# Altium schematic sheet Sheet1.SchDoc: Flyback SMPS
size A3; DocumentNumber: 1; SheetNumber: 1; SheetTotal: 1; SPICEModelCacheZDEPEACZ: <root> / <DocumentId>ZDEPEACZ</DocumentId> / <CacheFrame Number="0"> / <Model Name="890324025017cs_100nf" Kind="CKT"> / <Text>******* / .subckt 890324025017CS_100nF 1 2 / Rser 1 3 0.072 / Lser 2 4 0.000000004703 / C1 3 4 0.0000001 / Rpar 3 4 30000000000 / .ends 890324025017CS_100nF</Text> / </Model> / <Model Name="1206_885012208058_100nf" Kind="CKT"> / <Text>******* / .subckt 1206_885012208058_100nF 1 2 / Rser 1 3 0.0232208356231 / Lser 2 4 5.59299026E-10 / C1 3 4 0.0000001 / Rpar 3 4 5000000000 / .ends 1206_885012208058_100nF</Text> / </Model> / <Model Name="0603_885012006085_1nf" Kind="CKT"> / <Text>******* / .subckt 0603_885012006085_1nF 1 2 / Rser 1 3 0.0532527583524 / Lser 2 4 3.27557981E-10 / C1 3 4 0.000000001 / Rpar 3 4 10000000000 / .ends 0603_885012006085_1nF</Text> / </Model> / <Model Name="1210_885012209019_100nf" Kind="CKT"> / <Text>******* / .subckt 1210_885012209019_100nF 1 2 / Rser 1 3 0.0209574310072 / Lser 2 4 5.49171232E-10 / C1 3 4 0.0000001 / Rpar 3 4 5000000000 / .ends 1210_885012209019_100nF</Text> / </Model> / <Model Name="1206_885012208042_220pf" Kind="CKT"> / <Text>******* / .subckt 1206_885012208042_220pF 1 2 / Rser 1 3 0.58352 / Lser 2 4 0.00000000032083 / C1 3 4 0.00000000022 / Rpar 3 4 10000000000 / .ends 1206_885012208042_220pF</Text> / </Model> / </CacheFrame> / </root>
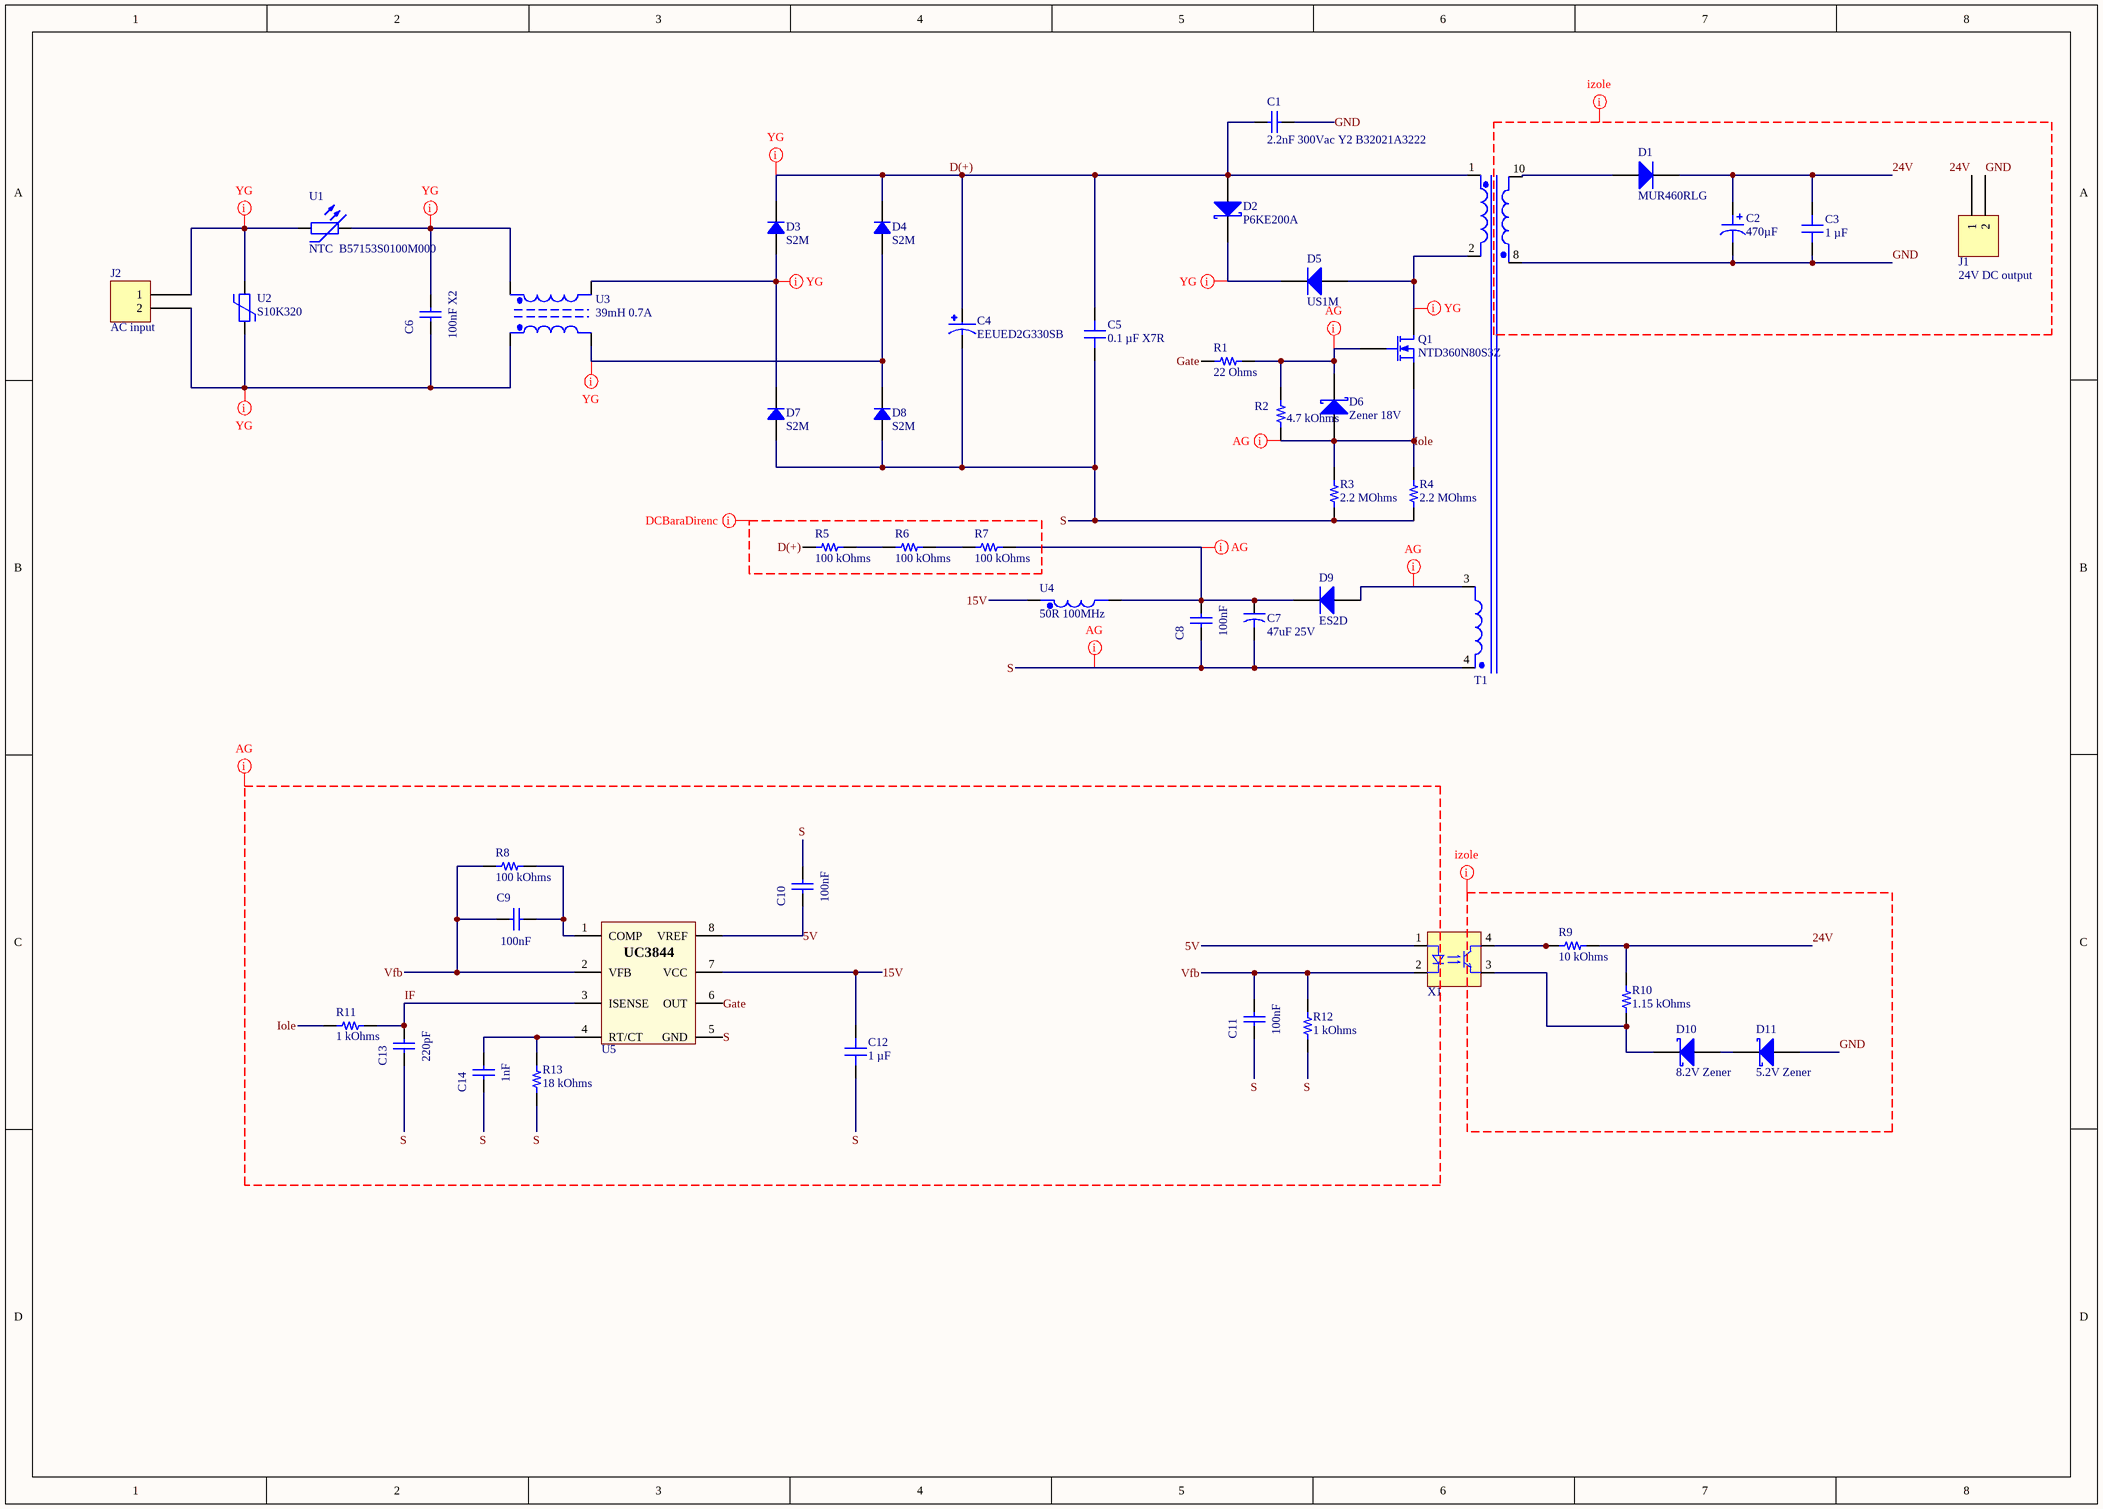
[diagram p0: Sheet1.SchDoc]

## Parts
C1  2.2nF 300Vac Y2 B32021A3222  [4x13x9]
C2  470µF  [CAP TH ALUM ELEC D10.00mm S5.00mm H20.00mm]
C3  1 µF  [CAP 1206_3216 - 0.8MM]
C4  EEUED2G330SB  [CAPPRD750W80D1600H2000]
C5  0.1 µF X7R  [CAP 1210_3225 - 1MM]
C6  100nF X2  [WCAP-FTX2_L18W6H12]
C7  47uF 25V  [CAPPRD200W50D525H1250]
C8  100nF  [WCAP-CSGP_1206_L3.2W1.6H0.8]
C9  100nF  [WCAP-CSGP_1210_L3.2W2.5H0.95]
C10  100nF  [WCAP-CSGP_1210_L3.2W2.5H0.95]
C11  100nF  [WCAP-CSGP_1210_L3.2W2.5H0.95]
C12  1 µF  [MURATA CAP GRM31C 1206_3216]
C13  220pF  [WCAP-CSGP_1206_L3.2W1.6H0.8]
C14  1nF  [WCAP-CSGP_0603_L1.6W0.8H0.8_Reflow]
D1  MUR460RLG  [DO-201AD -Dik]
D2  P6KE200A  [DO-15((DO-204AC)]
D3  S2M  [DO214AA SMB]
D4  S2M  [DO214AA SMB]
D5  US1M  [DO-214AA(SMB)]
D6  Zener 18V  [SOD-123]
D7  S2M  [DO214AA SMB]
D8  S2M  [DO214AA SMB]
D9  ES2D  [DO-214AA(SMB)]
D10  8.2V Zener  [SOD-123]
D11  5.2V Zener  [SOD-123]
J1  24V DC output  [JST S2B-PH-SM4-TB]
J2  AC input  [TE 282837-2]
Q1  NTD360N80S3Z  [DPAK IGBT]
R1  22 Ohms  [YAGEO RES 1206_3216]
R2  4.7 kOhms  [RES 1206_3216]
R3  2.2 MOhms  [YAGEO RES 1206_3216]
R4  2.2 MOhms  [YAGEO RES 1206_3216]
R5  100 kOhms  [YAGEO RES 1206_3216]
R6  100 kOhms  [YAGEO RES 1206_3216]
R7  100 kOhms  [YAGEO RES 1206_3216]
R8  100 kOhms  [RES 1206_3216]
R9  10 kOhms  [RES 1206_3216]
R10  1.15 kOhms  [RES 1206_3216]
R11  1 kOhms  [YAGEO RES 1206_3216]
R12  1 kOhms  [YAGEO RES 1206_3216]
R13  18 kOhms  [RES 1206_3216]
T1  SMPS Tr  [SMPS Tr3]  (value not drawn)
U1  NTC  B57153S0100M000  [NTC B57153S0100]
U2  S10K320  [Varistor630V]
U3  39mH 0.7A  [EMC SMPS TDK]
U4  50R 100MHz  [1206 Bead]
U5  UC3844  [SOIC-OA8_L]  (value not drawn)
X1  PC81710NIP1B  [PC817 SMD]  (value not drawn)

## Nets
5V: C10.1 U5.8(VREF) X1.1(A)
15V: C12.2 U4.1 U5.7(VCC)
24V: C2.1 C3.2 D1.2(K) J1.1 R9.2 R10.2
D(+): C1.1 C4.P C5.2 D2.1(A) D3.2 D4.2 R5.1 T1.1(Pri+)
Gate: R1.1 U5.6(OUT)
GND: C1.2 C2.2 C3.1 D11.1(A) J1.2 T1.8
IF: C13.2 R11.2 U5.3(ISENSE)
Iole: D6.1(A) Q1.3(S) R2.1 R3.2 R4.2 R11.1
S: C4.N C5.1 C7.2 C8.1 C10.2 C11.1 C12.1 C13.1 C14.1 D7.1 D8.1 R3.1 R4.1 R12.1 R13.1 T1.4(Sec3-) U5.5(GND)
Vfb: C9.1 C11.2 R8.1 R12.2 U5.2(VFB) X1.2(K)
NetC6_1: C6.1 J2.2 U2.1 U3.1
NetC6_2: C6.2 U1.2 U3.2
NetC7_1: C7.1 C8.2 D9.2(K) R7.2 U4.2
NetC9_2: C9.2 R8.2 U5.1(COMP)
NetC14_2: C14.2 R13.2 U5.4(RT/CT)
NetD1_1: D1.1(A) T1.10(Sec1+)
NetD2_2: D2.2(K) D5.2(K)
NetD3_1: D3.1 D7.2 U3.3
NetD4_1: D4.1 D8.2 U3.4
NetD5_1: D5.1(A) Q1.2(D) T1.2(Pri-)
NetD6_2: D6.2(K) Q1.1(G) R1.2 R2.2
NetD9_1: D9.1(A) T1.3(Sec3+)
NetD10_1: D10.1(A) D11.2(K)
NetD10_2: D10.2(K) R10.1 X1.3(E)
NetJ2_1: J2.1 U1.1 U2.2
NetR5_2: R5.2 R6.1
NetR6_2: R6.2 R7.1
NetR9_1: R9.1 X1.4(C)

## Layout directives
net class YG: D(+), NetC6_1, NetC6_2, NetD2_2, NetD3_1, NetD4_1, NetD5_1, NetJ2_1
net class AG: 5V, 15V, Gate, IF, Iole, NetC7_1, NetD6_2, NetD9_1, S, Vfb
net class izole: 24V, GND
net class DCBaraDirenc: D(+)

## Library data of the parts
C1 = Cap Y2 2.2nF 300V MKP TDK: 495-4967-1-ND; Published: 8-Jun-2000; LatestRevisionDate: 17-Jul-2002; LatestRevisionNote: Re-released for DXP Platform.; PackageReference: RAD-0.3; Publisher: Altium Limited; PackageDescription: Radial Cap, Thru-Hole; 2 Leads; 0.3 in Pin Spacing
C2 = EEU-FC1V471: CAP ALUM 470UF 20% 35V RADIAL; manufacturer: Panasonic Electronic Components; Impedance: 52 mOhms; Lifetime @ Temp.: 3000 Hrs @ 105°C; Polarization: Polar; Ripple Current @ High Frequency: 1.22A @ 100kHz; Ripple Current @ Low Frequency: 915mA @ 120Hz; Part Number: EEU-FC1V471; Applications: Automotive; Capacitance: 470µF; componentlink1description: Datasheet; componentlink1url: http://industrial.panasonic.com/www-cgi/jvcr13pz.cgi?E+PZ+3+ABA0022+EEUFC1V471+7+WW; componentlink2description: DigiKey Link; componentlink2url: http://digikey.com/product-detail/en/panasonic-electronic-components/EEU-FC1V471/P10301-ND/266310; Device Package: Radial, Can; Height - Seated (Max): 0.787" (20.00mm); lastupdated: 2.09.2020 01:31:31; Lead Spacing: 0.197" (5.00mm); Lifecycle Status: Active; Minimum Order: 1; Mounting Type: Through Hole; Operating Temperature: -55°C ~ 105°C; Package / Case: Radial, Can; packaging: Bulk; partid: 12504; Part Status: Active; price: 0.75; Ratings: AEC-Q200; series: FC; Size / Dimension: 0.394" Dia (10.00mm); Supplier 1: DigiKey; Supplier Part Number 1: P10301-ND; Tolerance: ±20%; value: 470µF; Voltage - Rated: 35V
C3 = CL31B105KBHNNNE: CAP CER 1UF 50V X7R 1206; manufacturer: Samsung Electro-Mechanics; Tolerance: ±10%; Part Number: CL31B105KBHNNNE; Capacitance: 1 µF; Applications: General Purpose; componentlink1description: Datasheet; componentlink1url: http://www.samsungsem.com/kr/support/product-search/mlcc/CL31B105KBHNNNE.jsp; componentlink2description: DigiKey Link; componentlink2url: https://www.digikey.com/en/products/detail/samsung-electro-mechanics/CL31B105KBHNNNE/3886726; Device Package: 1206 (3216 Metric); lastupdated: 4.06.2024 19:10:30; Lifecycle Status: Active; Minimum Order: 1; Mounting Type: Surface Mount, MLCC; Operating Temperature: -55°C ~ 125°C; Package / Case: 1206 (3216 Metric); packaging: TapeAndReel; partid: 43160; Part Status: Active; price: 0.02; series: CL; Size / Dimension: 0.126" L x 0.063" W (3.20mm x 1.60mm); Supplier 1: DigiKey; Supplier Part Number 1: 1276-1068-1-ND; Temperature Coefficient: X7R; Thickness (Max): 0.071" (1.80mm); value: 1 µF; Voltage - Rated: 50V
C4 = EEUED2G330SB: CAP ALUM 33UF 20% 400V RADIAL; MF: Panasonic; MP: EEU-ED2G330SB; Purchase-URL: https://pricing.snapeda.com/search/part/EEU-ED2G330SB/?ref=eda; Package: RADIAL-2 Panasonic; Check_prices: https://www.snapeda.com/parts/EEU-ED2G330SB/Panasonic/view-part/?ref=eda; SnapEDA_Link: https://www.snapeda.com/parts/EEU-ED2G330SB/Panasonic/view-part/?ref=snap; Price: None; Availability: In Stock; Value: *
C5 = 1210Y0500104KST: 1210 50VDC 100NF 10% X7R(2R1) AE; manufacturer: Knowles Syfer; Capacitance: 0.1 µF; Voltage - Rated: 50V; Part Number: 1210Y0500104KST; Value: 0.1 µF X7R; Applications: Automotive, Boardflex Sensitive; componentlink2description: DigiKey Link; componentlink2url: https://www.digikey.com/en/products/detail/knowles-syfer/1210Y0500104KST/18879780; Device Package: 1210 (3225 Metric); Features: Soft Termination; lastupdated: 4.06.2024 19:20:44; Lifecycle Status: Active; Minimum Order: 1; Mounting Type: Surface Mount, MLCC; Operating Temperature: -55°C ~ 125°C; Package / Case: 1210 (3225 Metric); packaging: TapeAndReel; partid: 53037; Part Status: Active; price: 0.16; Ratings: AEC-Q200; series: FlexiCap™; Size / Dimension: 0.126" L x 0.098" W (3.20mm x 2.50mm); Supplier 1: DigiKey; Supplier Part Number 1: 1608-1210Y0500104KSTCT-ND; Temperature Coefficient: X7R (2R1); Thickness (Max): 0.079" (2.00mm); Tolerance: ±10%
C6 = 890324025017CS: WCAP-FTX2 Film Capacitor, THT, L18 x W6 x H12mm, 100nF, 275V; Manufacturer: Wurth Elektronik; Capacitance Tolerance: +/-10%; Dissipation Factor @1kHz: 0.1%; Dissipation Factor @100kHz: 0.5%; Insulation Resistance: 30GΩ; Pitch: 15mm; Rate of Voltage Rise: 300V/μs; Technical Reference: MX2P015104K275ACPP46004; Manufacturer Part Number: 890324025017CS; Category: Film Capacitors; Match Code: WCAP-FTX2; ComponentLink1Description: Website Link; ComponentLink1URL: https://www.we-online.com/redexpert/article/890324025017CS?ad; ComponentLink2Description: Datasheet Link; ComponentLink2URL: https://www.we-online.com/redexpert/spec/890324025017CS?ad; Mount: Through Hole; Min Operating Temperature: -40°C; Max Operating Temperature: 105°C; Packaging: Carton; Length: 18mm; Width: 6mm; Height: 12mm; Capacitance: 100nF; Dissipation Factor @10kHz: 0.1%; Rated Voltage (AC): 275V
C7 = C 47uF 25V 250mArms 400mOhm: 1189-1590-1-ND; ComponentLink1Description: http://www.rubycon.co.jp/en/catalog/e_pdfs/aluminum/e_px.pdf
C8 = 885012208058: WCAP-CSGP Multilayer Ceramic Chip Capacitor, General Purpose, size 1206, 100nF, 25V; Manufacturer: Wurth Elektronik; Case/Size Code: 1206; Capacitance Tolerance: +/-10%; Ceramic Type: X7R; Dissipation Factor: 3.5%; Insulation Resistance: 5GΩ; Technical Reference: X7R1206104K025DFCT10000; Manufacturer Part Number: 885012208058; Category: Multilayer Ceramic Chip Capacitors; Match Code: WCAP-CSGP; ComponentLink1Description: Website Link; ComponentLink1URL: https://www.we-online.com/redexpert/article/885012208058?ad; ComponentLink2Description: Datasheet Link; ComponentLink2URL: https://www.we-online.com/redexpert/spec/885012208058?ad; Mount: Surface Mount; Min Operating Temperature: -55°C; Max Operating Temperature: 125°C; Packaging: Tape and Reel; Length: 3.2mm; Width: 1.6mm; Height: 0.8mm; Capacitance: 100nF; Rated Voltage (DC): 25V
C9-C11 = 885012209019: WCAP-CSGP Multilayer Ceramic Chip Capacitor, General Purpose, size 1210, 100nF, 25V; Manufacturer: Wurth Elektronik; Case/Size Code: 1210; Capacitance Tolerance: +/-10%; Ceramic Type: X7R; Dissipation Factor: 3.5%; Insulation Resistance: 5GΩ; Technical Reference: X7R1210104K025DFCT10000; Manufacturer Part Number: 885012209019; Category: Multilayer Ceramic Chip Capacitors; Match Code: WCAP-CSGP; ComponentLink1Description: Website Link; ComponentLink1URL: https://www.we-online.com/redexpert/article/885012209019?ad; ComponentLink2Description: Datasheet Link; ComponentLink2URL: https://www.we-online.com/redexpert/spec/885012209019?ad; Mount: Surface Mount; Min Operating Temperature: -55°C; Max Operating Temperature: 125°C; Packaging: Tape and Reel; Length: 3.2mm; Width: 2.5mm; Height: 0.95mm; Capacitance: 100nF; Rated Voltage (DC): 25V
C12 = GRM31CR71E105KA01L: CAP CER 1UF 25V X7R 1206; manufacturer: Murata Electronics; Tolerance: ±10%; Part Number: GRM31CR71E105KA01L; Capacitance: 1 µF; Applications: General Purpose; componentlink1description: Datasheet; componentlink1url: https://search.murata.co.jp/Ceramy/image/img/A01X/G101/ENG/GRM31CR71E105KA01-01.pdf; componentlink2description: DigiKey Link; componentlink2url: https://www.digikey.com/en/products/detail/murata-electronics/GRM31CR71E105KA01L/7033132; Device Package: 1206 (3216 Metric); lastupdated: 6.09.2024 02:27:21; Lifecycle Status: Active; Minimum Order: 1; Mounting Type: Surface Mount, MLCC; Operating Temperature: -55°C ~ 125°C; Package / Case: 1206 (3216 Metric); packaging: TapeAndReel; partid: 59149; price: 0.15; series: GRM; Size / Dimension: 0.126" L x 0.063" W (3.20mm x 1.60mm); Supplier 1: DigiKey; Supplier Part Number 1: 490-GRM31CR71E105KA01LCT-ND; Temperature Coefficient: X7R; Thickness (Max): 0.071" (1.80mm); value: 1 µF; Voltage - Rated: 25V
C13 = 885012208042: WCAP-CSGP Multilayer Ceramic Chip Capacitor, General Purpose, size 1206, 220pF, 25V; Manufacturer: Wurth Elektronik; Case/Size Code: 1206; Capacitance Tolerance: +/-10%; Ceramic Type: X7R; Dissipation Factor: 3.5%; Insulation Resistance: 10GΩ; Technical Reference: X7R1206221K025DFCT10000; Manufacturer Part Number: 885012208042; Category: Multilayer Ceramic Chip Capacitors; Match Code: WCAP-CSGP; ComponentLink1Description: Website Link; ComponentLink1URL: https://www.we-online.com/redexpert/article/885012208042?ad; ComponentLink2Description: Datasheet Link; ComponentLink2URL: https://www.we-online.com/redexpert/spec/885012208042?ad; Mount: Surface Mount; Min Operating Temperature: -55°C; Max Operating Temperature: 125°C; Packaging: Tape and Reel; Length: 3.2mm; Width: 1.6mm; Height: 0.8mm; Capacitance: 220pF; Rated Voltage (DC): 25V
C14 = 885012006085: WCAP-CSGP Multilayer Ceramic Chip Capacitor, General Purpose, size 0603, 1nF, 100V; Manufacturer: Wurth Elektronik; Case/Size Code: 0603; Capacitance Tolerance: +/-5%; Ceramic Type: NP0; Insulation Resistance: 10GΩ; Q Factor: 1000; Technical Reference: NP00603102J100DFCT10000; Manufacturer Part Number: 885012006085; Category: Multilayer Ceramic Chip Capacitors; Match Code: WCAP-CSGP; ComponentLink1Description: Website Link; ComponentLink1URL: https://www.we-online.com/redexpert/article/885012006085?ad; ComponentLink2Description: Datasheet Link; ComponentLink2URL: https://www.we-online.com/redexpert/spec/885012006085?ad; Mount: Surface Mount; Min Operating Temperature: -55°C; Max Operating Temperature: 125°C; Packaging: Tape and Reel; Length: 1.6mm; Width: 0.8mm; Height: 0.8mm; Capacitance: 1nF; Rated Voltage (DC): 100V
D1 = Diyot DO-201AD Dik: MUR460RLGOSCT-ND
D2 = TVS 200V DO-15: 497-13419-1-ND; Note: Pin 2 is not connected and not drawn.; Published: 21-Mar-2003; LatestRevisionDate: 29-May-2009; LatestRevisionNote: IPC-7351 Footprint Added.; DatasheetVersion: Oct-1999; PackageVersion: Sep-2001; PackageReference: SOT-23; Publisher: Altium Limited; PackageDescription: 3-Pin SOT-23 Package 0.95 mm Pitch, 2.5 mm Lead Span; ComponentLink1Description: Manufacturer Link; ComponentLink1URL: http://www.infineon.com/; ComponentLink2Description: Datasheet; ComponentLink2URL: http://www.infineon.com/upload/Document/cmc_upload/documents/009/363/bat17series.pdf
D3 D4 D7 D8 = S2M: DIODE GEN PURP 1KV 2A DO214AA; Manufacturer: ON Semiconductor; Capacitance @ Vr, F: 30pF @ 4V, 1MHz; Current - Reverse Leakage @ Vr: 1µA @ 1000V; Diode Type: Standard; Reverse Recovery Time (trr): 2µs; Speed: Standard Recovery >500ns, > 200mA (Io); Voltage - DC Reverse (Vr) (Max): 1000V; Voltage - Forward (Vf) (Max) @ If: 1.15V @ 2A; Part Number: S2M; ComponentLink1Description: Datasheet; ComponentLink1URL: https://www.onsemi.com/pub/Collateral/S2M-D.pdf; ComponentLink2Description: DigiKey Link; ComponentLink2URL: http://digikey.com/product-detail/en/on-semiconductor/S2M/S2MFSCT-ND/2094442; Current - Average Rectified (Io): 2A; LastUpdated: 3.06.2024 19:53:56; Lifecycle Status: Active; Minimum Order: 1; Mounting Type: Surface Mount; Operating Temperature - Junction: -65°C ~ 150°C; Package / Case: DO-214AA, SMB; Packaging: TapeAndReel; PartId: 299; Part Status: Active; Price: 0.06; Series: -; Supplier 1: DigiKey; Supplier Part Number 1: S2MFSCT-ND; Supplier Device Package: DO-214AA (SMB)
D5 = US1M: SMA
D6 D10 D11 = Zener SOD-123: SOD-123; Note: Pin 2 is not connected and not drawn.; Published: 21-Mar-2003; LatestRevisionDate: 29-May-2009; LatestRevisionNote: IPC-7351 Footprint Added.; DatasheetVersion: Oct-1999; PackageVersion: Sep-2001; PackageReference: SOT-23; Publisher: Altium Limited; PackageDescription: 3-Pin SOT-23 Package 0.95 mm Pitch, 2.5 mm Lead Span; ComponentLink1Description: Manufacturer Link; ComponentLink1URL: http://www.infineon.com/; ComponentLink2Description: Datasheet; ComponentLink2URL: http://www.infineon.com/upload/Document/cmc_upload/documents/009/363/bat17series.pdf
D9 = D ES2D: ES2DFSCT-ND
J1 = S2B-PH-SM4-TB(LF)(SN): CONN HEADER SMD R/A 2POS 2MM; Manufacturer: JST Sales America Inc.; Contact Length - Mating: 0.130" (3.30mm); Current Rating (Amps): 2A; Material Flammability Rating: UL94 V-0; Number of Positions: 2; Number of Positions Loaded: All; Pitch - Mating: 0.079" (2.00mm); Shrouding: Shrouded - 4 Wall; Style: Board to Cable/Wire; Voltage Rating: 100V; Part Number: S2B-PH-SM4-TB(LF)(SN); ComponentLink1Description: Datasheet; ComponentLink1URL: http://www.jst-mfg.com/product/pdf/eng/ePH.pdf; ComponentLink2Description: DigiKey Link; ComponentLink2URL: http://digikey.com/product-detail/en/jst-sales-america-inc/S2B-PH-SM4-TB-LF-SN/455-1749-1-ND/926846; Connector Type: Header; Contact Finish - Mating: Tin; Contact Finish - Post: Tin; Contact Material: Copper Alloy; Contact Shape: Square; Contact Type: Male Pin; Fastening Type: Detent Lock; Features: Solder Retention; Insulation Color: Natural; Insulation Height: 0.217" (5.51mm); Insulation Material: Polyamide (PA6T), Nylon 6T; LastUpdated: 15.01.2020 03:45:11; Lifecycle Status: Active; Minimum Order: 1; Mounting Type: Surface Mount, Right Angle; Number of Rows: 1; Operating Temperature: -25°C ~ 85°C; Packaging: TapeAndReel; PartId: 115; Part Status: Active; Price: 0.27; Series: PH; Supplier 1: DigiKey; Supplier Part Number 1: 455-1749-1-ND; Termination: Solder
J2 = 282837-2: TERM BLK 2P SIDE ENT 5.08MM PCB; Manufacturer: TE Connectivity AMP Connectors; Current: 13.5 A; Mating Orientation: Horizontal with Board; Number of Levels: 1; Pitch: 0.200" (5.08mm); Positions Per Level: 2; Voltage: 300 V; Wire Gauge: 16-28 AWG; Wire Termination: Screw - Rising Cage Clamp; Part Number: 282837-2; Color: Green; ComponentLink1Description: Datasheet; ComponentLink1URL: https://www.te.com/commerce/DocumentDelivery/DDEController?Action=srchrtrv&DocNm=282837&DocType=Customer+Drawing&DocLang=English; ComponentLink2Description: DigiKey Link; ComponentLink2URL: https://www.digikey.com/en/products/detail/te-connectivity-amp-connectors/282837-2/2187973; Features: Interlocking (Side); LastUpdated: 21.06.2022 15:00:23; Lifecycle Status: Active; Minimum Order: 1; Mounting Type: Through Hole; Packaging: Tray; Part Status: Active; Price: 0.31; Series: Buchanan; Supplier 1: DigiKey; Supplier Part Number 1: A113320-ND
Q1 = MOSFET DPAK: DPAK; Published: 8-Jun-2000; LatestRevisionDate: 17-Jul-2002; LatestRevisionNote: Re-released for DXP Platform.; PackageVersion: 1995/1996; PackageReference: E3; Publisher: Altium Limited; PackageDescription: TO, Flat Index; 3 In-Line, Axial Leads; Body Dia. 4.6mm; Lead Dia. 0.5 mm (max)
R1 = AC1206JR-0722RL: RES SMD 22 OHM 5% 1/4W 1206; Manufacturer: Yageo; Power (Watts): 0.25W, 1/4W; Temperature Coefficient: ±100ppm/°C; Part Number: AC1206JR-0722RL; ComponentLink1Description: Datasheet; ComponentLink1URL: https://www.yageo.com/upload/media/product/productsearch/datasheet/rchip/PYu-AC_51_RoHS_L_7.pdf; ComponentLink2Description: DigiKey Link; ComponentLink2URL: https://www.digikey.com/en/products/detail/yageo/AC1206JR-0722RL/5897810; Composition: Thick Film; Device Package: 1206 (3216 Metric); Features: Automotive AEC-Q200, Moisture Resistant; Height - Seated (Max): 0.026" (0.65mm); LastUpdated: 25.07.2024 09:21:37; Lifecycle Status: Active; Minimum Order: 1; Number of Terminations: 2; Operating Temperature: -55°C ~ 155°C; Package / Case: 1206 (3216 Metric); Packaging: TapeAndReel; PartId: 27520; Part Status: Active; Price: 0.01; Ratings: AEC-Q200; Resistance: 22 Ohms; Series: AC; Size / Dimension: 0.122" L x 0.063" W (3.10mm x 1.60mm); Supplier 1: DigiKey; Supplier Part Number 1: YAG3939CT-ND; Supplier Device Package: 1206; Tolerance: ±5%; Value: 22 Ohms
R2 = CRGCQ1206F4K7: RES 4.7K OHM 1% 1/4W 1206; Manufacturer: TE Connectivity Passive Product; Power (Watts): 0.25W, 1/4W; Temperature Coefficient: ±100ppm/°C; Part Number: CRGCQ1206F4K7; ComponentLink1Description: Datasheet; ComponentLink1URL: https://www.te.com/commerce/DocumentDelivery/DDEController?Action=srchrtrv&DocNm=1773204-3&DocType=DS&DocLang=English; ComponentLink2Description: DigiKey Link; ComponentLink2URL: https://www.digikey.com/en/products/detail/te-connectivity-passive-product/CRGCQ1206F4K7/8576420; Composition: Thick Film; Device Package: 1206 (3216 Metric); Features: Automotive AEC-Q200, Moisture Resistant; Height - Seated (Max): 0.026" (0.65mm); LastUpdated: 9.02.2024 20:54:44; Lifecycle Status: Active; Minimum Order: 1; Number of Terminations: 2; Operating Temperature: -55°C ~ 155°C; Package / Case: 1206 (3216 Metric); Packaging: TapeAndReel; PartId: 26997; Part Status: Active; Price: 0.01; Ratings: AEC-Q200; Resistance: 4.7 kOhms; Series: CRGCQ; Size / Dimension: 0.122" L x 0.061" W (3.10mm x 1.55mm); Supplier 1: DigiKey; Supplier Part Number 1: A129818CT-ND; Supplier Device Package: 1206; Tolerance: ±1%; Value: 4.7 kOhms
R3 R4 = RC1206FR-132M2L: RES 2.2 MOHM 1% 1/4W 1206; Manufacturer: Yageo; Power (Watts): 0.25W, 1/4W; Temperature Coefficient: ±100ppm/°C; Part Number: RC1206FR-132M2L; ComponentLink1Description: Datasheet; ComponentLink1URL: https://www.yageo.com/upload/media/product/products/datasheet/rchip/PYu-RC_Group_51_RoHS_L_12.pdf; ComponentLink2Description: DigiKey Link; ComponentLink2URL: https://www.digikey.com/en/products/detail/yageo/RC1206FR-132M2L/17017064; Composition: Thick Film; Device Package: 1206 (3216 Metric); Features: Moisture Resistant; Height - Seated (Max): 0.026" (0.65mm); LastUpdated: 25.07.2024 09:21:13; Lifecycle Status: Active; Minimum Order: 1; Number of Terminations: 2; Operating Temperature: -55°C ~ 155°C; Package / Case: 1206 (3216 Metric); Packaging: TapeAndReel; PartId: 89146; Price: 0.01; Resistance: 2.2 MOhms; Series: RC_L; Size / Dimension: 0.122" L x 0.063" W (3.10mm x 1.60mm); Supplier 1: DigiKey; Supplier Part Number 1: 13-RC1206FR-132M2LCT-ND; Supplier Device Package: 1206; Tolerance: ±1%; Value: 2.2 MOhms
R5-R7 = RT1206BRB07100KL: RES SMD 100K OHM 0.1% 1/4W 1206; Manufacturer: Yageo; Power (Watts): 0.25W, 1/4W; Temperature Coefficient: ±10ppm/°C; Part Number: RT1206BRB07100KL; ComponentLink1Description: Datasheet; ComponentLink1URL: https://www.yageo.com/upload/media/product/productsearch/datasheet/rchip/PYu-RT_1-to-0.01_RoHS_L_11.pdf; ComponentLink2Description: DigiKey Link; ComponentLink2URL: https://www.digikey.com/en/products/detail/yageo/RT1206BRB07100KL/5936250; Composition: Thin Film; Device Package: 1206 (3216 Metric); Height - Seated (Max): 0.026" (0.65mm); LastUpdated: 25.07.2024 09:21:38; Lifecycle Status: Active; Minimum Order: 1; Number of Terminations: 2; Operating Temperature: -55°C ~ 155°C; Package / Case: 1206 (3216 Metric); Packaging: TapeAndReel; PartId: 26928; Part Status: Active; Price: 0.22; Resistance: 100 kOhms; Series: RT; Size / Dimension: 0.122" L x 0.063" W (3.10mm x 1.60mm); Supplier 1: DigiKey; Supplier Part Number 1: YAG5016CT-ND; Supplier Device Package: 1206; Tolerance: ±0.1%; Value: 100 kOhms
R8 = CRG1206F100K: RES SMD 100K OHM 1% 1/4W 1206; Manufacturer: TE Connectivity Passive Product; Power (Watts): 0.25W, 1/4W; Temperature Coefficient: ±100ppm/°C; Part Number: CRG1206F100K; ComponentLink1Description: Datasheet; ComponentLink1URL: https://www.te.com/commerce/DocumentDelivery/DDEController?Action=srchrtrv&DocNm=1773204&DocType=DS&DocLang=English; ComponentLink2Description: DigiKey Link; ComponentLink2URL: https://www.digikey.com/en/products/detail/te-connectivity-passive-product/CRG1206F100K/2389961; Composition: Thick Film; Device Package: 1206 (3216 Metric); Height - Seated (Max): 0.026" (0.65mm); LastUpdated: 9.02.2024 20:54:44; Lifecycle Status: Active; Minimum Order: 1; Number of Terminations: 2; Operating Temperature: -55°C ~ 155°C; Package / Case: 1206 (3216 Metric); Packaging: TapeAndReel; PartId: 26988; Part Status: Active; Price: 0.01; Resistance: 100 kOhms; Series: CRG, Neohm; Size / Dimension: 0.122" L x 0.061" W (3.10mm x 1.55mm); Supplier 1: DigiKey; Supplier Part Number 1: A106067CT-ND; Supplier Device Package: 1206; Tolerance: ±1%; Value: 100 kOhms
R9 = CRG1206F10K: RES SMD 10K OHM 1% 1/4W 1206; Manufacturer: TE Connectivity Passive Product; Power (Watts): 0.25W, 1/4W; Temperature Coefficient: ±100ppm/°C; Part Number: CRG1206F10K; ComponentLink1Description: Datasheet; ComponentLink1URL: https://www.te.com/commerce/DocumentDelivery/DDEController?Action=srchrtrv&DocNm=1773204&DocType=DS&DocLang=English; ComponentLink2Description: DigiKey Link; ComponentLink2URL: https://www.digikey.com/en/products/detail/te-connectivity-passive-product/CRG1206F10K/2389909; Composition: Thick Film; Device Package: 1206 (3216 Metric); Height - Seated (Max): 0.026" (0.65mm); LastUpdated: 9.02.2024 20:54:44; Lifecycle Status: Active; Minimum Order: 1; Number of Terminations: 2; Operating Temperature: -55°C ~ 155°C; Package / Case: 1206 (3216 Metric); Packaging: TapeAndReel; PartId: 26989; Part Status: Active; Price: 0.01; Resistance: 10 kOhms; Series: CRG, Neohm; Size / Dimension: 0.122" L x 0.061" W (3.10mm x 1.55mm); Supplier 1: DigiKey; Supplier Part Number 1: A106069CT-ND; Supplier Device Package: 1206; Tolerance: ±1%; Value: 10 kOhms
R10 = CRCW12061K15FKEA: RES SMD 1.15K OHM 1% 1/4W 1206; Manufacturer: Vishay Dale; Power (Watts): 0.25W, 1/4W; Temperature Coefficient: ±100ppm/°C; Part Number: CRCW12061K15FKEA; ComponentLink1Description: Datasheet; ComponentLink1URL: http://www.vishay.com/docs/20035/dcrcwe3.pdf; ComponentLink2Description: DigiKey Link; ComponentLink2URL: https://www.digikey.com/en/products/detail/vishay-dale/CRCW12061K15FKEA/1176650; Composition: Thick Film; Device Package: 1206 (3216 Metric); Features: Automotive AEC-Q200; Height - Seated (Max): 0.024" (0.60mm); LastUpdated: 9.02.2024 20:54:36; Lifecycle Status: Active; Minimum Order: 1; Number of Terminations: 2; Operating Temperature: -55°C ~ 155°C; Package / Case: 1206 (3216 Metric); Packaging: TapeAndReel; PartId: 28813; Part Status: Active; Price: 0.01; Ratings: AEC-Q200; Resistance: 1.15 kOhms; Series: CRCW; Size / Dimension: 0.126" L x 0.063" W (3.20mm x 1.60mm); Supplier 1: DigiKey; Supplier Part Number 1: 541-1.15KFCT-ND; Supplier Device Package: 1206; Tolerance: ±1%; Value: 1.15 kOhms
R11 R12 = RC1206FR-071KL: RES 1K OHM 1% 1/4W 1206; Manufacturer: Yageo; Power (Watts): 0.25W, 1/4W; Temperature Coefficient: ±100ppm/°C; Part Number: RC1206FR-071KL; ComponentLink1Description: Datasheet; ComponentLink1URL: https://www.yageo.com/upload/media/product/productsearch/datasheet/rchip/PYu-RC_Group_51_RoHS_L_10.pdf; ComponentLink2Description: DigiKey Link; ComponentLink2URL: https://www.digikey.com/en/products/detail/yageo/RC1206FR-071KL/728387; Composition: Thick Film; Device Package: 1206 (3216 Metric); Features: Moisture Resistant; Height - Seated (Max): 0.026" (0.65mm); LastUpdated: 25.07.2024 09:21:38; Lifecycle Status: Active; Minimum Order: 1; Number of Terminations: 2; Operating Temperature: -55°C ~ 155°C; Package / Case: 1206 (3216 Metric); Packaging: TapeAndReel; PartId: 26978; Part Status: Active; Price: 0.01; Resistance: 1 kOhms; Series: RC_L; Size / Dimension: 0.122" L x 0.063" W (3.10mm x 1.60mm); Supplier 1: DigiKey; Supplier Part Number 1: 311-1.00KFRCT-ND; Supplier Device Package: 1206; Tolerance: ±1%; Value: 1 kOhms
R13 = CRGCQ1206F18K: RES 18K OHM 1% 1/4W 1206; Manufacturer: TE Connectivity Passive Product; Power (Watts): 0.25W, 1/4W; Temperature Coefficient: ±100ppm/°C; Part Number: CRGCQ1206F18K; ComponentLink1Description: Datasheet; ComponentLink1URL: https://www.te.com/commerce/DocumentDelivery/DDEController?Action=srchrtrv&DocNm=1773204-3&DocType=DS&DocLang=English; ComponentLink2Description: DigiKey Link; ComponentLink2URL: https://www.digikey.com/en/products/detail/te-connectivity-passive-product/CRGCQ1206F18K/8576427; Composition: Thick Film; Device Package: 1206 (3216 Metric); Features: Automotive AEC-Q200, Moisture Resistant; Height - Seated (Max): 0.026" (0.65mm); LastUpdated: 9.02.2024 20:54:44; Lifecycle Status: Active; Minimum Order: 1; Number of Terminations: 2; Operating Temperature: -55°C ~ 155°C; Package / Case: 1206 (3216 Metric); Packaging: TapeAndReel; PartId: 27008; Part Status: Active; Price: 0.01; Ratings: AEC-Q200; Resistance: 18 kOhms; Series: CRGCQ; Size / Dimension: 0.122" L x 0.061" W (3.10mm x 1.55mm); Supplier 1: DigiKey; Supplier Part Number 1: A129825CT-ND; Supplier Device Package: 1206; Tolerance: ±1%; Value: 18 kOhms
T1 = SMPS Tr EF25: Sim Note: Enter the turns ratios, Core loss resistance, Magnetising Reactance, Leakage Reactances and Resistances referred to the primary side into the parameter fields.; Published: 25-Jan-2001; LatestRevisionDate: 17-Jul-2002; LatestRevisionNote: Re-released for DXP Platform.; PackageReference: TRF_8; Publisher: Altium Limited; PackageDescription: Transformer; 8 Leads
U1 = NTC 10R 2A 8.5mm: 495-2076-ND; Published: 8-Jun-2000; LatestRevisionDate: 17-Jul-2002; LatestRevisionNote: Re-released for DXP Platform.; PackageReference: AXIAL-0.4; Publisher: Altium Limited; PackageDescription: Axial Device, Thru-Hole; 2 Leads; 0.4 in Pin Spacing
U2 = Varistor S10K320: Published: 8-Jun-2000; LatestRevisionDate: 17-Jul-2002; LatestRevisionNote: Re-released for DXP Platform.; PackageReference: AXIAL-0.4; Publisher: Altium Limited; PackageDescription: Axial Device, Thru-Hole; 2 Leads; 0.4 in Pin Spacing
U3 = EMC SMPS TDK 39mH 0.7A: 495-2781-ND
U4 = Bead 1206: SMD 1206
U5 = UC3844: SOIC8; PackageReference: SOIC-OA8
X1 = PC817: 1855-1014-1-ND